# Altium schematic sheet Voltage Regulator.SchDoc
size A4; SheetNumber: 4; SheetTotal: 6
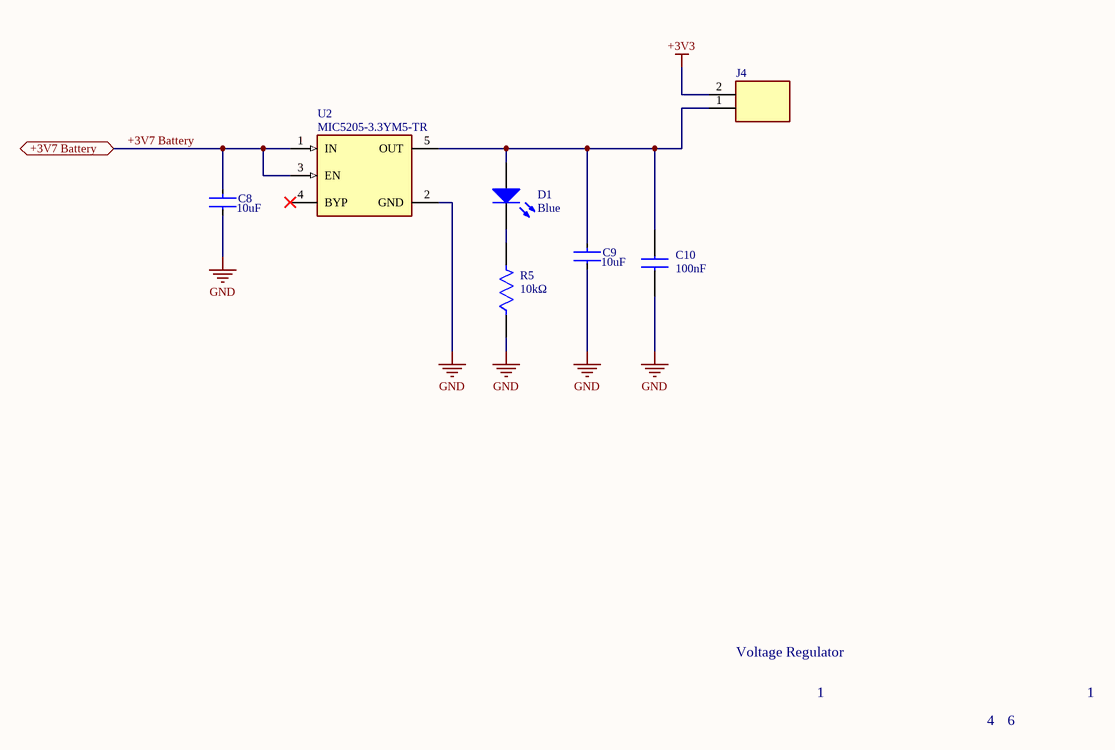
[diagram p0: Voltage Regulator.SchDoc]

## Parts
C8  value 10uF  [FP-GCM21B-0_2-e0_2_0_7-MFG]  (hidden comment: GCM21BC71E106KE36L)
C9  value 10uF  [FP-GCM21B-0_2-e0_2_0_7-MFG]  (hidden comment: GCM21BC71E106KE36L)
C10  value 100nF  [CAPC2013X137N]  (hidden comment: 0805B104K500NT)
D1  Color: Blue  [WL-SMCW_1206_150120xx75000]  (hidden comment: 150120BS75000)
J4  87527-2  [HDRV2W66P0X254_1X2_467X244X1044P]  (value not drawn)
R5  value 10kΩ  [FP-CR0805-IPC_A]  (hidden comment: CR0805-FX-1002ELF)
U2  MIC5205-3.3YM5-TR  [FP-M5-MFG]

## Ports
+3V7 Battery (bidir, see Encode Schematic[2B], Battery Charger[3C], Battery Protection[3C])

## Nets
+3V3: J4.2
GND: C8.2 C9.2 C10.2 R5.1 U2.2(GND)
+3V7 Battery: C8.1 U2.1(IN) U2.3(EN) ; port +3V7 Battery
NetC9_1: C9.1 C10.1 D1.2(A) J4.1 U2.5(OUT)
NetD1_1: D1.1(K) R5.2

Not connected (* = marked no-connect by the designer): U2 4(BYP)*

## Notes on the sheet
- Voltage Regulator
- 1
- 4
- 6

## Library data of the parts
C8 C9 = CMP-06035-063206-1: 10 µF ±10% 25V Ceramic Capacitor X7S 0805 (2012 Metric)
C10 = 0805B104K500NT: Capacitor; Manufacturer_Name: Novacap; Datasheet Link: https://componentsearchengine.com/Datasheets/1/0805B104K500NT.pdf; Height: 1.37mm; Manufacturer_Part_Number: 0805B104K500NT; Mouser Part Number: 767-0805B104K500NT; Mouser Price/Stock: https://www.mouser.com/Search/Refine.aspx?Keyword=767-0805B104K500NT
D1 = CMP-1426-00015-2: NexarPartId: 29717786; Manufacturer Package Identifier: LED_1206; Peak Wavelength: 465nm; Dominant Wavelength: 470nm; Viewing Angle: 140°; Lens Style: Clear, Rectangular; Max Reverse Voltage (DC): 5V; Test Current: 20mA; Forward Voltage: 3.2V; Forward Current: 100mA; Luminous Intensity: 145mcd; Case Code (Metric): 3216; Case/Package: 1206; Length: 3.2mm; Packaging: Tape and Reel; Case Code (Imperial): 1206; Min Operating Temperature: -40°C; REACH SVHC: Unknown; Height: 680µm; Mount: Surface Mount; Max Operating Temperature: 85°C; RoHS: Compliant; Width: 1.6mm; Wavelength: 470nm
J4 = 87527-2: Power isolation jumper; Manufacturer_Name: TE Connectivity; Datasheet Link: https://www.te.com/commerce/DocumentDelivery/DDEController?Action=showdoc&DocId=Customer+Drawing%7F87527%7FH%7Fpdf%7FEnglish%7FENG_CD_87527_H.pdf%7F87527-2; Height: 10.439mm; Manufacturer_Part_Number: 87527-2; Mouser Part Number: 571-875272; Mouser Price/Stock: https://www.mouser.co.uk/ProductDetail/TE-Connectivity/87527-2?qs=ZDXmSm13593hsB4j%252B6gMfg%3D%3D; Arrow Part Number: 87527-2; Arrow Price/Stock: https://www.arrow.com/en/products/87527-2/te-connectivity?region=nac
R5 = CMP-07231-003204-1: Thick Film Chip Resistors 0805 10kΩ 0.125W 1% 100ppm/°C; Max Power Dissipation: 125mW; Voltage Rating: 150V; Voltage Rating (DC): 100V; Resistance: 10kR; Height: 0.5mm; Tolerance: 1%; Max Operating Temperature: 155°C; Thickness: 508um; Radiation Hardening: No; Packaging: Tape and Reel; Depth: 1.25mm; Contact Plating: Tin; Package Quantity: 1; Case Code (Metric): 2012; REACH SVHC: No SVHC; Min Operating Temperature: -55°C; Power Rating: 125mW; Mount: Surface Mount; Length: 2mm; Case Code (Imperial): 0805; Width: 1.25mm; Temperature Coefficient: 100ppm/°C; Termination: SMD/SMT; Composition: Thick Film; Features: Moisture Resistant; Case/Package: 0805; Number of Terminations: 2
U2 = CMP-06324-000014-1: IC REG LINEAR 3.3V 150MA SOT23-5; Manufacturer: Microchip; Number Of Outputs: 1; Output Type: Fixed; Min Supply Voltage: 2.5V; Accuracy Percentage: 2%; Dropout Voltage: 165mV; Max Supply Voltage: 16V; Max Junction Temp: +125°C; Standoff Height: 0mm; Digikey Description: IC REG LINEAR 3.3V 150MA SOT23-5; Output Current: 150mA; Temperature: -40°C to +125°C; Temperature Range High: +125°C; Height: 1.45mm; ComponentLink2URL: http://ww1.microchip.com/downloads/en/DeviceDoc/20005785A.pdf; Mouser Description: LDO Voltage Regulators; Device Class L3: Voltage Regulators - Linear; Package: M5; Temperature Range Low: -40°C; Device Class L1: Integrated Circuits (ICs); ComponentLink2Description: Datasheet; Automotive: No; Ipc Land Pattern Name: SOT95P280X118-5; Octopart: https://octopart.com/mic5205-3.3ym5-tr-microchip-66802130; Device Class L2: Power Management ICs; Manufacturer Part Number: MIC5205-3.3YM5-TR; Lead Free: Yes; RoHS: TRUE